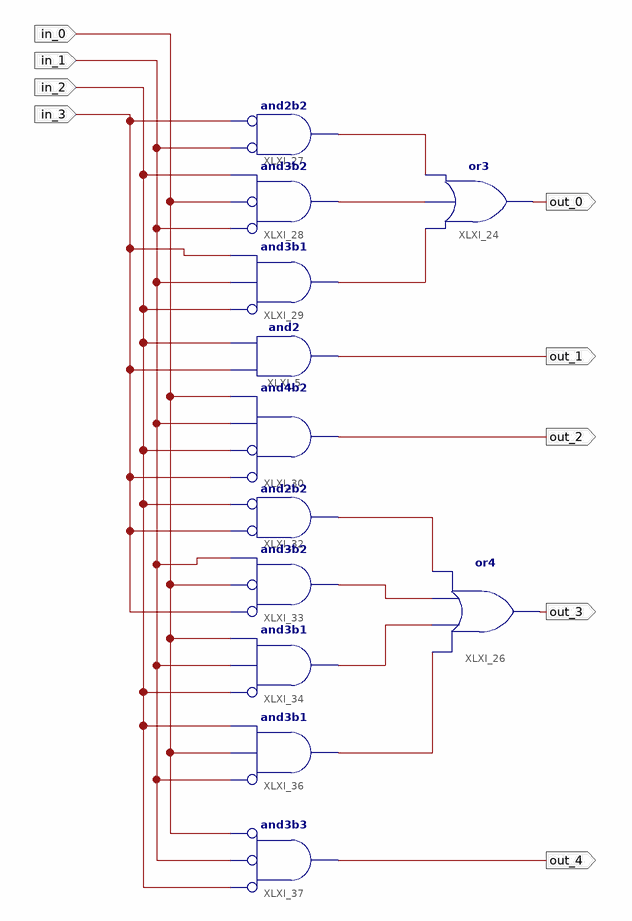
[diagram p0: schematic sheet 1]
// Xilinx ISE schematic Lutsyk_scheme.sch (spartan3a) as structural Verilog: 12 symbols, 9 ports
module Lutsyk_scheme (
  input  in_3,
  input  in_1,
  input  in_0,
  input  in_2,
  output out_0,
  output out_1,
  output out_2,
  output out_3,
  output out_4
);

  wire XLXN_52, XLXN_53, XLXN_54, XLXN_62, XLXN_63, XLXN_64, XLXN_65;

  or XLXI_24 (out_0, XLXN_54, XLXN_53, XLXN_52);
  or XLXI_26 (out_3, XLXN_65, XLXN_64, XLXN_63, XLXN_62);
  and XLXI_27 (XLXN_52, ~in_1, ~in_3);  // and2b2
  and XLXI_28 (XLXN_53, ~in_1, ~in_0, in_2);  // and3b2
  and XLXI_29 (XLXN_54, ~in_2, in_1, in_3);  // and3b1
  and XLXI_30 (out_2, ~in_3, ~in_2, in_1, in_0);  // and4b2
  and XLXI_5 (out_1, in_3, in_2);
  and XLXI_32 (XLXN_62, ~in_3, ~in_2);  // and2b2
  and XLXI_34 (XLXN_64, ~in_2, in_1, in_0);  // and3b1
  and XLXI_33 (XLXN_63, ~in_3, ~in_0, in_1);  // and3b2
  and XLXI_36 (XLXN_65, ~in_1, in_0, in_2);  // and3b1
  and XLXI_37 (out_4, ~in_2, ~in_1, ~in_0);  // and3b3
endmodule
